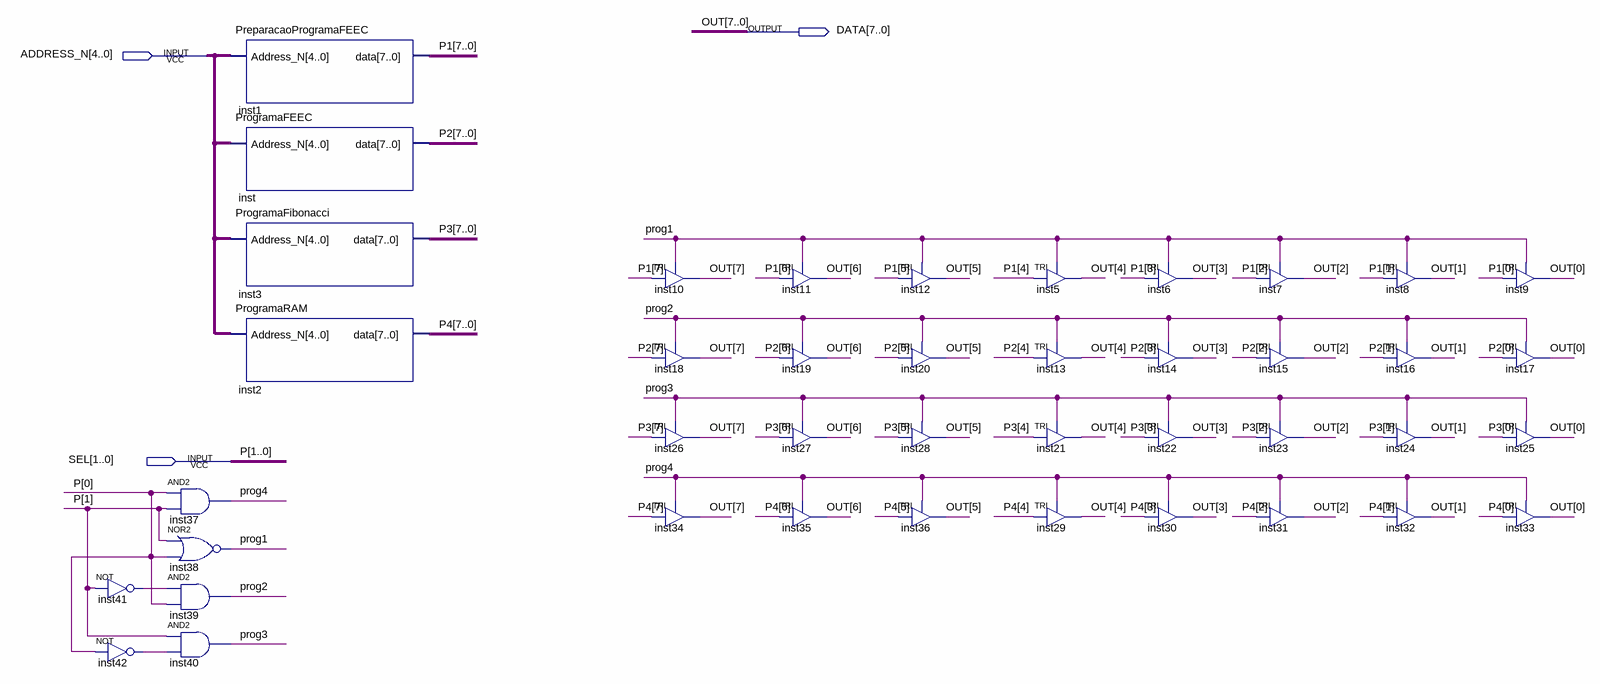
[diagram p0: schematic sheet]
// Quartus schematic SeletorDeProgramas.bdf as structural Verilog: 42 symbols, 3 pins
module SeletorDeProgramas (
  input  [4:0] ADDRESS_N,
  input  [1:0] SEL,
  output [7:0] DATA
);

  wire inst41_out, inst42_out, prog1, prog2, prog3, prog4;
  wire [7:0] P1, P2, P3, P4;

  not inst41 (inst41_out, SEL[1]);
  not inst42 (inst42_out, SEL[0]);
  and inst37 (prog4, SEL[0], SEL[1]);
  nor inst38 (prog1, SEL[1], SEL[0]);
  and inst39 (prog2, inst41_out, SEL[0]);
  and inst40 (prog3, SEL[1], inst42_out);
  PreparacaoProgramaFEEC inst1 (.Address_N(ADDRESS_N), .data(P1));
  ProgramaFEEC inst (.Address_N(ADDRESS_N), .data(P2));
  ProgramaFibonacci inst3 (.Address_N(ADDRESS_N), .data(P3));
  ProgramaRAM inst2 (.Address_N(ADDRESS_N), .data(P4));
  TRI inst10 (.IN(P1[7]), .OE(prog1), .OUT(DATA[7]));
  TRI inst18 (.IN(P2[7]), .OE(prog2), .OUT(DATA[7]));
  TRI inst26 (.IN(P3[7]), .OE(prog3), .OUT(DATA[7]));
  TRI inst34 (.IN(P4[7]), .OE(prog4), .OUT(DATA[7]));
  TRI inst11 (.IN(P1[6]), .OE(prog1), .OUT(DATA[6]));
  TRI inst19 (.IN(P2[6]), .OE(prog2), .OUT(DATA[6]));
  TRI inst27 (.IN(P3[6]), .OE(prog3), .OUT(DATA[6]));
  TRI inst35 (.IN(P4[6]), .OE(prog4), .OUT(DATA[6]));
  TRI inst12 (.IN(P1[5]), .OE(prog1), .OUT(DATA[5]));
  TRI inst20 (.IN(P2[5]), .OE(prog2), .OUT(DATA[5]));
  TRI inst28 (.IN(P3[5]), .OE(prog3), .OUT(DATA[5]));
  TRI inst36 (.IN(P4[5]), .OE(prog4), .OUT(DATA[5]));
  TRI inst5 (.IN(P1[4]), .OE(prog1), .OUT(DATA[4]));
  TRI inst13 (.IN(P2[4]), .OE(prog2), .OUT(DATA[4]));
  TRI inst21 (.IN(P3[4]), .OE(prog3), .OUT(DATA[4]));
  TRI inst29 (.IN(P4[4]), .OE(prog4), .OUT(DATA[4]));
  TRI inst6 (.IN(P1[3]), .OE(prog1), .OUT(DATA[3]));
  TRI inst14 (.IN(P2[3]), .OE(prog2), .OUT(DATA[3]));
  TRI inst22 (.IN(P3[3]), .OE(prog3), .OUT(DATA[3]));
  TRI inst30 (.IN(P4[3]), .OE(prog4), .OUT(DATA[3]));
  TRI inst7 (.IN(P1[2]), .OE(prog1), .OUT(DATA[2]));
  TRI inst15 (.IN(P2[2]), .OE(prog2), .OUT(DATA[2]));
  TRI inst23 (.IN(P3[2]), .OE(prog3), .OUT(DATA[2]));
  TRI inst31 (.IN(P4[2]), .OE(prog4), .OUT(DATA[2]));
  TRI inst8 (.IN(P1[1]), .OE(prog1), .OUT(DATA[1]));
  TRI inst16 (.IN(P2[1]), .OE(prog2), .OUT(DATA[1]));
  TRI inst24 (.IN(P3[1]), .OE(prog3), .OUT(DATA[1]));
  TRI inst32 (.IN(P4[1]), .OE(prog4), .OUT(DATA[1]));
  TRI inst9 (.IN(P1[0]), .OE(prog1), .OUT(DATA[0]));
  TRI inst17 (.IN(P2[0]), .OE(prog2), .OUT(DATA[0]));
  TRI inst25 (.IN(P3[0]), .OE(prog3), .OUT(DATA[0]));
  TRI inst33 (.IN(P4[0]), .OE(prog4), .OUT(DATA[0]));

  // Other names for the same wires on the sheet: OUT[7:0] = DATA; P[1:0] = SEL
endmodule
